# Altium schematic sheet DM2097_RIGHT_OV9282.SchDoc: =project_title
size Tabloid; CompanyName: Luxonis Holding; Organization: Luxonis Holding; Address1: 1925 Harmony Park Drive; Address2: Westminster, CO; Address3: 80234; Address4: United States; SheetNumber: 6; SheetTotal: 17
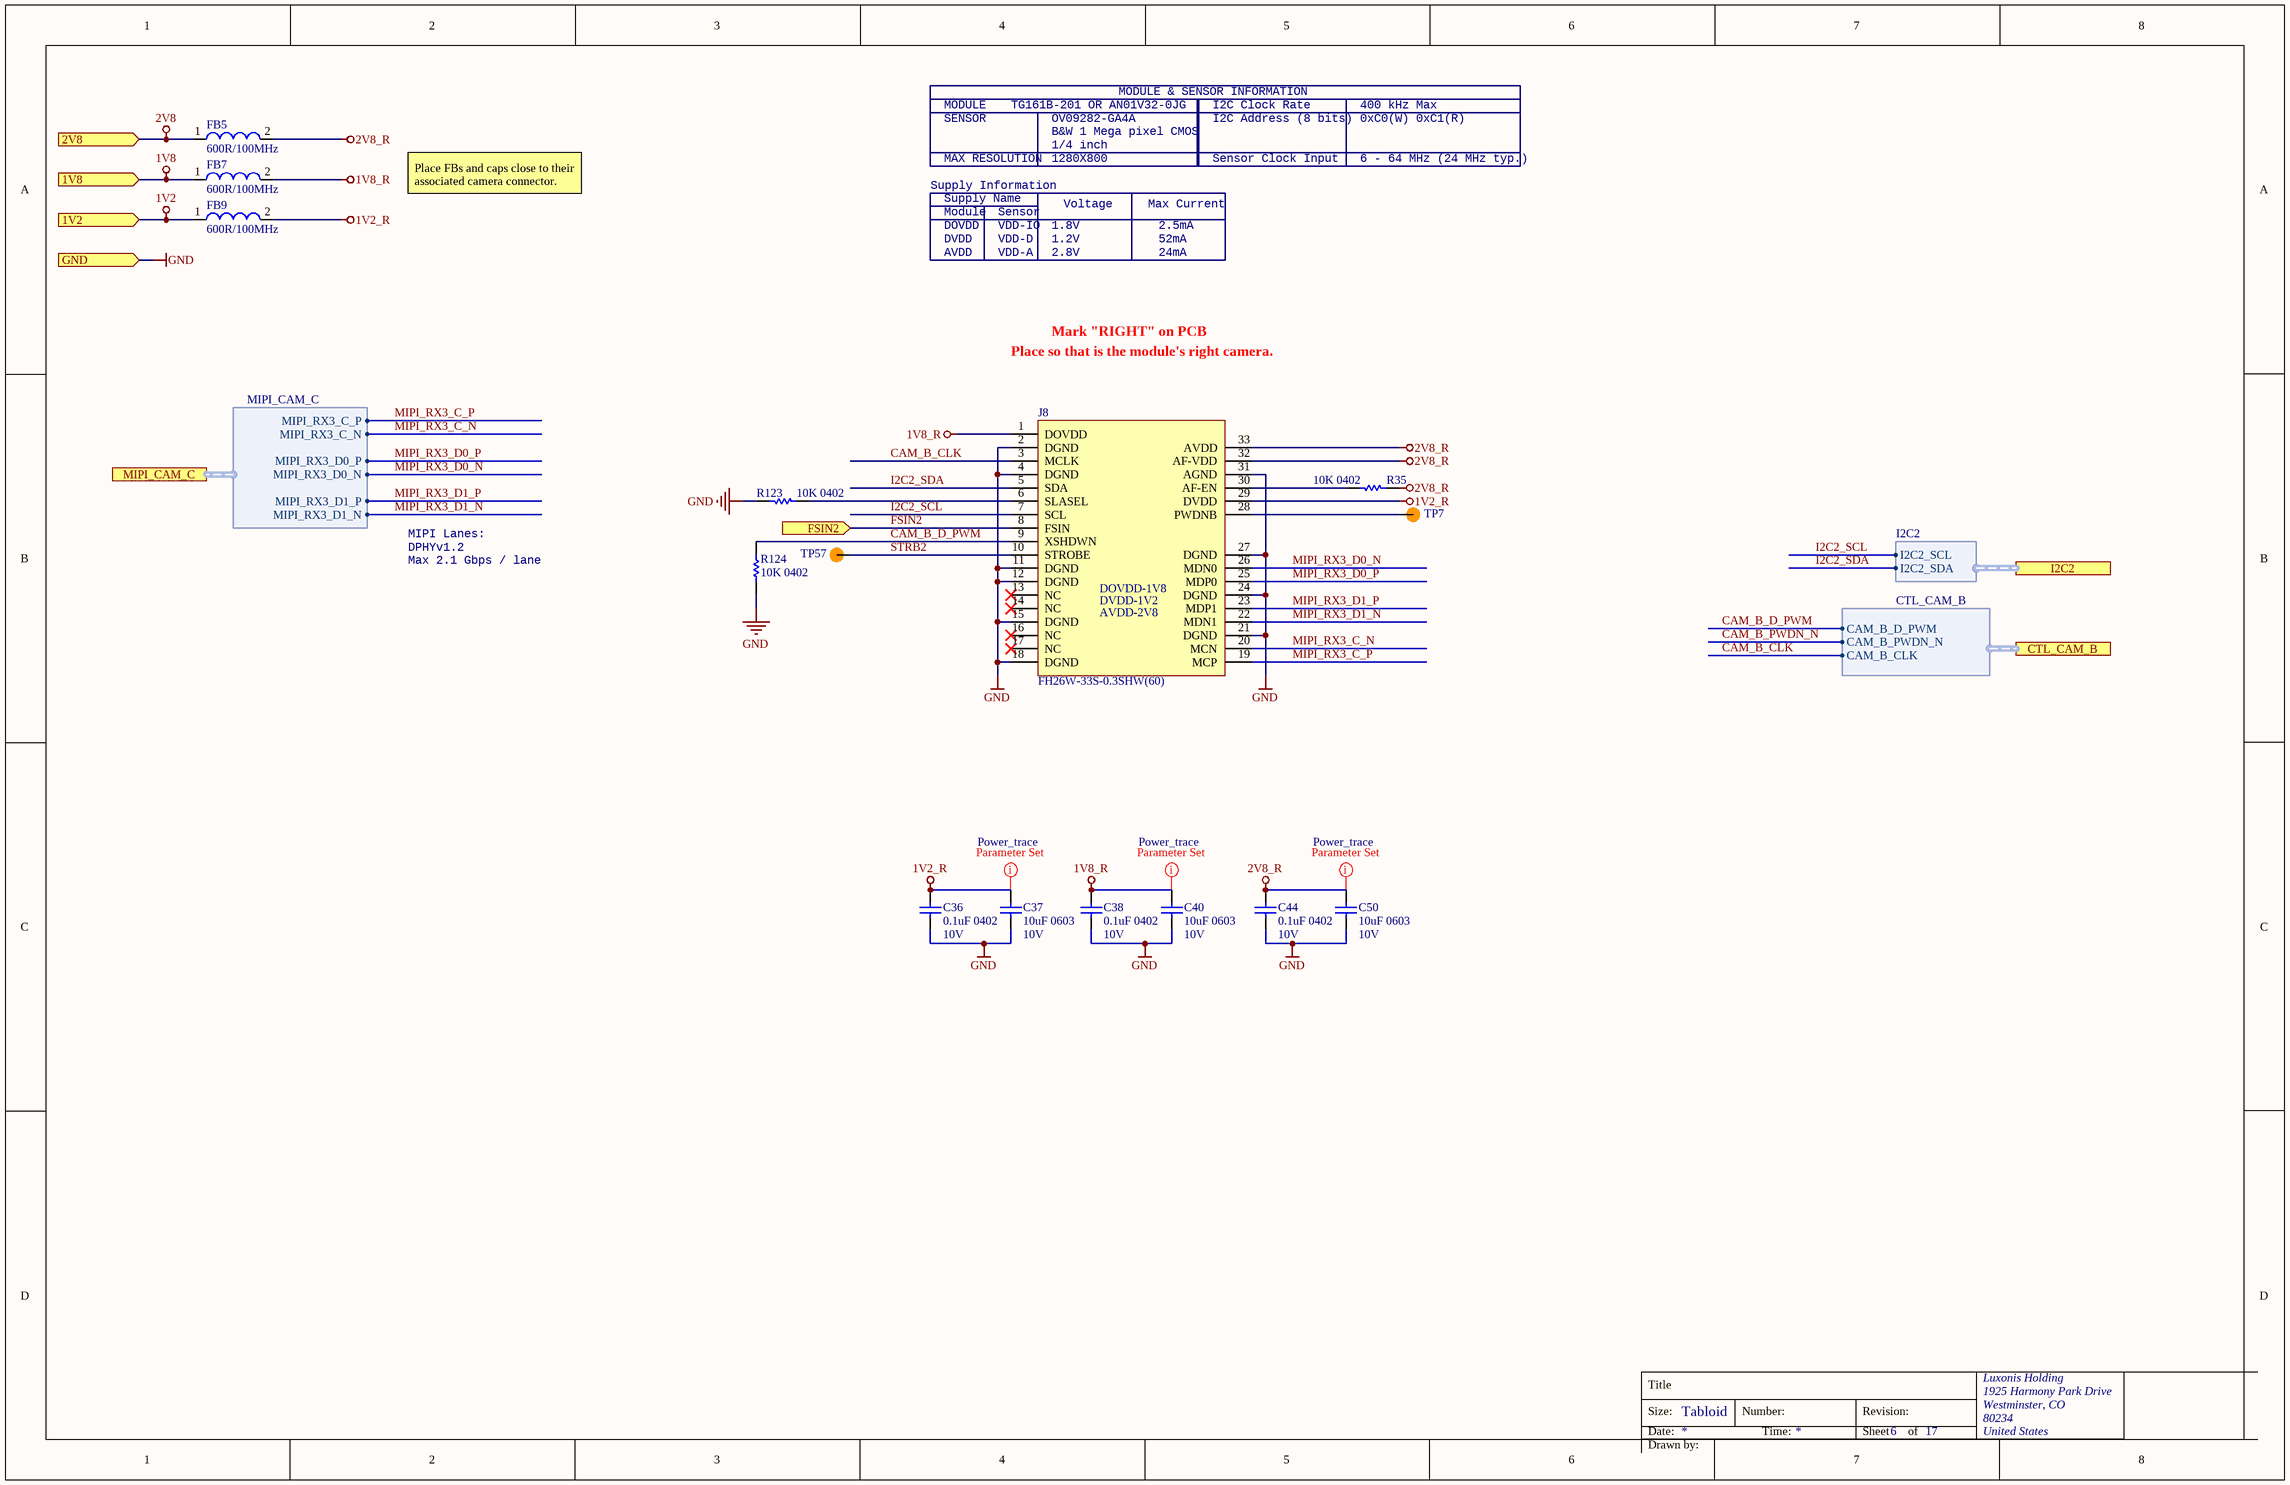
[diagram p0: DM2097_RIGHT_OV9282.SchDoc]

## Parts
C36  0.1uF 0402  Voltage Rating: 10V  [CAPC0402(1005)70_L]
C37  10uF 0603  Voltage Rating: 10V  [CAPC0603(1608)100_L]
C38  0.1uF 0402  Voltage Rating: 10V  [CAPC0402(1005)70_L]
C40  10uF 0603  Voltage Rating: 10V  [CAPC0603(1608)100_L]
C44  0.1uF 0402  Voltage Rating: 10V  [CAPC0402(1005)70_L]
C50  10uF 0603  Voltage Rating: 10V  [CAPC0603(1608)100_L]
FB5  600R/100MHz  [2508056017Y2]
FB7  600R/100MHz  [2508056017Y2]
FB9  600R/100MHz  [2508056017Y2]
J8  FH26W-33S-0.3SHW(60)  [AC-PY003-OV9282]
R35  10K 0402  [RESC0402(1005)_L]
R123  10K 0402  [RESC0402(1005)_L]
R124  10K 0402  [RESC0402(1005)_L]
TP7  TP100_200_NS  [TP100_200_NS]  (value not drawn)  (no BOM)
TP57  TP100_200_NS  [TP100_200_NS]  (value not drawn)  (no BOM)

## Ports
1V2 (in), 1V8 (in), 2V8 (in), CTL_CAM_B (harness CTL_CAM_B), FSIN2 (in), GND (in), I2C2 (harness I2C2), MIPI_CAM_C (harness MIPI_CAM_C)

## Harnesses
MIPI_CAM_C: MIPI_RX3_C_P, MIPI_RX3_C_N, MIPI_RX3_D0_P, MIPI_RX3_D0_N, MIPI_RX3_D1_P, MIPI_RX3_D1_N
I2C2: I2C2_SDA, I2C2_SCL
CTL_CAM_B: CAM_B_CLK, CAM_B_PWDN_N, CAM_B_D_PWM

## Nets
1V2: FB9.1 ; port 1V2
1V2_R: C36.2 C37.2 FB9.2 J8.29(DVDD)
1V8: FB7.1 ; port 1V8
1V8_R: C38.2 C40.2 FB7.2 J8.1(DOVDD)
2V8: FB5.1 ; port 2V8
2V8_R: C44.2 C50.2 FB5.2 J8.32(AF-VDD) J8.33(AVDD) R35.2
GND: C36.1 C37.1 C38.1 C40.1 C44.1 C50.1 J8.2(DGND) J8.4(DGND) J8.11(DGND) J8.12(DGND) J8.15(DGND) J8.18(DGND) J8.21(DGND) J8.24(DGND) J8.27(DGND) J8.31(AGND) R123.1 R124.1 ; port GND
CAM_B_CLK: J8.3(MCLK) ; port CTL_CAM_B.CAM_B_CLK
CAM_B_D_PWM: J8.9(XSHDWN) R124.2 ; port CTL_CAM_B.CAM_B_D_PWM
CAM_B_PWDN_N: port CTL_CAM_B.CAM_B_PWDN_N
FSIN2: J8.8(FSIN) ; port FSIN2
I2C2_SCL: J8.7(SCL) ; port I2C2.I2C2_SCL
I2C2_SDA: J8.5(SDA) ; port I2C2.I2C2_SDA
MIPI_RX3_C_N: J8.20(MCN) ; port MIPI_CAM_C.MIPI_RX3_C_N
MIPI_RX3_C_P: J8.19(MCP) ; port MIPI_CAM_C.MIPI_RX3_C_P
MIPI_RX3_D0_N: J8.26(MDN0) ; port MIPI_CAM_C.MIPI_RX3_D0_N
MIPI_RX3_D0_P: J8.25(MDP0) ; port MIPI_CAM_C.MIPI_RX3_D0_P
MIPI_RX3_D1_N: J8.22(MDN1) ; port MIPI_CAM_C.MIPI_RX3_D1_N
MIPI_RX3_D1_P: J8.23(MDP1) ; port MIPI_CAM_C.MIPI_RX3_D1_P
STRB2: J8.10(STROBE) TP57.1
NetJ8_6: J8.6(SLASEL) R123.2
NetJ8_28: J8.28(PWDNB) TP7.1
NetJ8_30: J8.30(AF-EN) R35.1

Not connected (* = marked no-connect by the designer): J8 13(NC)* 14(NC)* 16(NC)* 17(NC)*

## Layout directives
net class Power_trace: 1V2_R, 1V8_R, 2V8_R

## Notes on the sheet
- MODULE & SENSOR INFORMATION
- SENSOR
- MODULE
- MAX RESOLUTION
- TG161B-201 OR AN01V32-0JG
- B&W 1 Mega pixel CMOS
- 1280X800
- OV09282-GA4A
- 1/4 inch
- I2C Address (8 bits)
- I2C Clock Rate
- Sensor Clock Input
- 400 kHz Max
- 6 - 64 MHz (24 MHz typ.)
- 0xC0(W) 0xC1(R)
- Place FBs and caps close to their associated camera connector.
- Supply Information
- DOVDD
- Supply Name
- Module
- VDD-IO
- Sensor
- 1.8V
- Voltage
- Max Current
- 2.5mA
- AVDD
- DVDD
- VDD-A
- VDD-D
- 2.8V
- 1.2V
- 24mA
- 52mA
- Place so that is the module's right camera.
- Mark "RIGHT" on PCB
- MIPI Lanes:
- Max 2.1 Gbps / lane
- DPHYv1.2
- Title
- Size:
- Date:
- Tabloid
- Number:
- Time:
- Revision:
- Sheet
- of
- Drawn by:
- (in symbol AC_PY003-OV9282_CON) DOVDD-1V8; DVDD-1V2; AVDD-2V8

## Library data of the parts
C36 C38 C44 = GRM155R71A104JA01D: CAP CER 0.1UF 10V X7R 0402 5%; Manufacturer 1: Murata; Capacitance: 100nF; Manufacturer Part Number 1: GRM155R71A104JA01D; Supplier 1: Digi-Key; Stock 1: 1346709; Pricing 1: 1=0.10000, 10=0.02500, 100=0.01130, 500=0.00806, 1000=0.00633, 2500=0.00575, 5000=0.00529 (USD); RoHS: Yes; Mount: Surface Mount; Case/Package: 0402; Case Code (Imperial): 0402; Case Code (Metric): 1005; Min Operating Temperature: -55°C; Max Operating Temperature: 125°C; Tolerance: 5%; Packaging: Tape and Reel; Voltage Rating (DC): 10V; Dielectric: X7R; Package Quantity: 10000; Termination: SMD/SMT; Length: 1mm; Height: 0.5mm; Width: 0.02inch; Thickness: 0.022inch; Depth: 0.5mm; Radiation Hardening: No; Lead Free: Lead Free; ComponentLink1URL: https://datasheet.ciiva.com/5411/product-5411135.pdf?src-supplier=Mouser; ComponentLink1Description: https://datasheet.ciiva.com/5411/product-5411135.pdf?src-supplier=Mouser; ComponentLink2URL: https://datasheet.ciiva.com/11618/c02e-11618821.pdf?src-supplier=Avnet; ComponentLink2Description: https://datasheet.ciiva.com/11618/c02e-11618821.pdf?src-supplier=Avnet; Supplier Part Number 1: 490-10777-1-ND
C37 C40 C50 = GRM188R61A106ME69D: CAP CER 10UF 10V X5R 0603 20%; Manufacturer 1: Murata; Material: Ceramic; Manufacturer Part Number 1: GRM188R61A106ME69D; Supplier 1: Digi-Key; Stock 1: 2873098; Pricing 1: 1=0.21000, 10=0.14100, 100=0.07130, 500=0.04876, 1000=0.04313 (USD); RoHS: Yes; Mount: Surface Mount; Case/Package: 0603; Weight: 0.000222oz; Case Code (Metric): 1608; Case Code (Imperial): 0603; Min Operating Temperature: -55°C; Max Operating Temperature: 85°C; Packaging: Tape and Reel; Tolerance: 20%; Capacitance: 10uF; Dielectric: X5R; Voltage Rating (DC): 10V; Package Quantity: 4000; Termination: SMD/SMT; Length: 1.6mm; Height: 0.8mm; Width: 0.8mm; Thickness: 0.035inch; Depth: 0.8mm; REACH SVHC: Unknown; Lead Free: Lead Free; ComponentLink1URL: http://www.mouser.com/ds/2/281/c02e-2905.pdf?src-supplier=Mouser; ComponentLink1Description: http://www.mouser.com/ds/2/281/c02e-2905.pdf?src-supplier=Mouser; ComponentLink2URL: http://components.arrow.com/part/dataview/0323_06119472?src-supplier=Arrow+Europe; ComponentLink2Description: http://components.arrow.com/part/dataview/0323_06119472?src-supplier=Arrow+Europe; ComponentLink3URL: http://www.farnell.com/datasheets/2048014.pdf?src-supplier=Farnell; ComponentLink3Description: http://www.farnell.com/datasheets/2048014.pdf?src-supplier=Farnell; ComponentLink4URL: http://www.farnell.com/datasheets/1872210.pdf?src-supplier=Farnell; ComponentLink4Description: http://www.farnell.com/datasheets/1872210.pdf?src-supplier=Farnell; ComponentLink5URL: http://search.murata.co.jp/Ceramy/image/img/A01X/G101/ENG/GRM188R61A106ME69-01.pdf?src-supplier=Digi-Key; ComponentLink5Description: http://search.murata.co.jp/Ceramy/image/img/A01X/G101/ENG/GRM188R61A106ME69-01.pdf?src-supplier=Digi-Key; ComponentLink6URL: http://www.farnell.com/datasheets/1872210.pdf?src-supplier=Newark; ComponentLink6Description: http://www.farnell.com/datasheets/1872210.pdf?src-supplier=Newark; ComponentLink7URL: http://www.farnell.com/datasheets/2048014.pdf?src-supplier=Element14; ComponentLink7Description: http://www.farnell.com/datasheets/2048014.pdf?src-supplier=Element14; ComponentLink8URL: http://www.farnell.com/datasheets/2048014.pdf?src-supplier=Newark; ComponentLink8Description: http://www.farnell.com/datasheets/2048014.pdf?src-supplier=Newark; Supplier Part Number 1: 490-10475-1-ND
FB5 FB7 FB9 = 2508056017Y2: FERRITE BEAD, 0.1OHM, 2A, 0805, 600R/100MHz; Manufacturer 1: Fair-Rite; Impedance: 600R; Tolerance: 25%; Resistance: 350mR; DC Resistance (DCR): 100mR; Test Frequency: 100MHz; Manufacturer Part Number 1: 2508056017Y2; Supplier 1: Digi-Key; Stock 1: 100491; Pricing 1: 1=0.10000, 10=0.07900, 25=0.07120, 50=0.05240, 100=0.04520, 250=0.03568, 500=0.03014, 1000=0.02538 (USD); RoHS: Yes; Case/Package: 0805; Number of Pins: 2; Case Code (Metric): 2012; Case Code (Imperial): 0805; Min Operating Temperature: -55°C; Max Operating Temperature: 125°C; Package Quantity: 4000; Packaging: Tape and Reel; Max DC Current: 2A; Termination: SMD/SMT; Military Standard: Not; DC Current: 2A; Current Rating: 2A; Frequency: 100MHz; Length: 2mm; Height: 0.9mm; Width: 1.25mm; Depth: 1.25mm; Radiation Hardening: No; REACH SVHC: No SVHC; ComponentLink1URL: https://datasheet.ciiva.com/3854/3802508056017y2-3854245.pdf?src-supplier=Arrow; ComponentLink1Description: https://datasheet.ciiva.com/3854/3802508056017y2-3854245.pdf?src-supplier=Arrow; ComponentLink2URL: https://datasheet.ciiva.com/22735/652149-22735047.pdf?src-supplier=Element14; ComponentLink2Description: https://datasheet.ciiva.com/22735/652149-22735047.pdf?src-supplier=Element14; ComponentLink3URL: https://datasheet.ciiva.com/1127/26143-1127514.pdf?src-supplier=Farnell; ComponentLink3Description: https://datasheet.ciiva.com/1127/26143-1127514.pdf?src-supplier=Farnell; ComponentLink4URL: https://datasheet.ciiva.com/18090/getdatasheetpartid-212640-18090187.pdf?src-supplier=Verical; ComponentLink4Description: https://datasheet.ciiva.com/18090/getdatasheetpartid-212640-18090187.pdf?src-supplier=Verical; ComponentLink5URL: https://datasheet.ciiva.com/7620/26143-7620140.pdf?src-supplier=Element14; ComponentLink5Description: https://datasheet.ciiva.com/7620/26143-7620140.pdf?src-supplier=Element14; Supplier Part Number 1: 1934-1487-1-ND
J8 = AC_PY003-OV9282_CON: FFC/FPC Connector, 33 Contact(s), 1 Row(s), Female, Right Angle, Surface Mount Terminal; Manufacturer 1: Hirose; Supplier 1: Digi-Key; Manufacturer Part Number 1: FH26W-33S-0.3SHW(60); RoHS: Yes; Category: FFC / FPC; Stock 1: 627; Pricing 1: 1=1,78000, 10=1,61700, 25=1,51800, 50=1,45200, 100=1,38600, 250=1,25400, 500=1,15500, 1000=0,99000, 2500=0,92400 (USD); ComponentLink1URL: https://datasheet.ciiva.com:443/pdfs/VipMasterIC/IC/HIRO/HIRO-S-A0007913874/HIRO-S-A0008593114-1.pdf?src-supplier=IHS+Markit; ComponentLink1Description: https://datasheet.ciiva.com:443/pdfs/VipMasterIC/IC/HIRO/HIRO-S-A0007913874/HIRO-S-A0008593114-1.pdf?src-supplier=IHS+Markit; ComponentLink2URL: https://www.hirose.com/product/en/download_file/key_name/FH26/category/Catalog/doc_file_id/49355/?file_category_id=4&item_id=298&is_series=1&src-supplier=Digi-Key; ComponentLink2Description: https://www.hirose.com/product/en/download_file/key_name/FH26/category/Catalog/doc_file_id/49355/?file_category_id=4&item_id=298&is_series=1&src-supplier=Digi-Key; ComponentLink3URL: https://www.hirose.com/product/download/?distributor=digikey&amp;type=2d&amp;lang=en&amp;num=FH26W-13S-0.3SHW(60)&src-supplier=Digi-Key; ComponentLink3Description: https://www.hirose.com/product/download/?distributor=digikey&amp;type=2d&amp;lang=en&amp;num=FH26W-13S-0.3SHW(60)&src-supplier=Digi-Key; Supplier Part Number 1: H125800CT-ND
R35 R123 R124 = RC0402FR-1310KL: RES SMD 10K OHM 1% 0402 1/16W Chip Resistor, 0402 [1005 Metric], 10 kohm, RC Series, 50 V, Thick Film, 62.5 mW; Manufacturer 1: Yageo; Resistance: 10kR; Temperature Coefficient: 100ppm/°C; Power Rating: 62.5mW; Voltage Rating: 50V; ComponentLink1URL: https://datasheet.ciiva.com/16940/pyu-rc0402-51-rohs-l-6-16940293.pdf?src-supplier=Avnet+Europe; ComponentLink1Description: https://datasheet.ciiva.com/16940/pyu-rc0402-51-rohs-l-6-16940293.pdf?src-supplier=Avnet+Europe; ComponentLink2URL: https://datasheet.ciiva.com/28386/pyu-rc0402-51-rohs-l-6-28386855.pdf?src-supplier=Avnet+Europe; ComponentLink2Description: https://datasheet.ciiva.com/28386/pyu-rc0402-51-rohs-l-6-28386855.pdf?src-supplier=Avnet+Europe; ComponentLink3URL: https://datasheet.ciiva.com/16740/pyu-rc0402-51-rohs-l-6-r-16740602.pdf?src-supplier=Future+Electronics; ComponentLink3Description: https://datasheet.ciiva.com/16740/pyu-rc0402-51-rohs-l-6-r-16740602.pdf?src-supplier=Future+Electronics; ComponentLink4URL: https://datasheet.ciiva.com/8891/pyu-rc0402-51-rohs-l-6-8891339.pdf?src-supplier=Avnet; ComponentLink4Description: https://datasheet.ciiva.com/8891/pyu-rc0402-51-rohs-l-6-8891339.pdf?src-supplier=Avnet; ComponentLink5URL: https://datasheet.ciiva.com/5557/pyu-rc0402-51-rohs-l-6-r-5557997.pdf?src-supplier=Mouser; ComponentLink5Description: https://datasheet.ciiva.com/5557/pyu-rc0402-51-rohs-l-6-r-5557997.pdf?src-supplier=Mouser; ComponentLink6URL: https://datasheet.ciiva.com/7983/1018594-7983533.pdf?src-supplier=Element14; ComponentLink6Description: https://datasheet.ciiva.com/7983/1018594-7983533.pdf?src-supplier=Element14; Supplier 1: Newark; Manufacturer Part Number 1: RC0402FR-1310KL; Stock 1: 62239; Pricing 1: 1=0.10000, 25=0.01200, 100=0.00400, 250=0.00400, 500=0.00300, 1000=0.00300 (USD); RoHS: Yes; Case/Package: 0402; Number of Pins: 2; Contact Plating: Tin,Matte,Lead; Case Code (Imperial): 0402; Case Code (Metric): 1005; Min Operating Temperature: -55°C; Max Operating Temperature: 155°C; Tolerance: 1%; Composition: Thick Film; Packaging: Tape and Reel; Termination: SMD/SMT; Military Standard: Not; Voltage Rating (DC): 50V; Working Voltage: 50V; Number of Terminations: 2; Length: 1mm; Depth: 0.5mm; Radiation Hardening: No; REACH SVHC: No SVHC; Lead Free: Lead Free; Supplier Part Number 1: 67R9960; Supplier 2: Future Electronics; Supplier 3: Mouser; Supplier 4: Element14; Supplier Part Number 2: RC0402FR-1310KL-CUTT; Supplier Part Number 3: 603-RC0402FR-1310KL; Supplier Part Number 4: 1799235
TP7 TP57 = TEST_POINT